# Altium schematic sheet RF Switch.SchDoc
size B; Organization: MASA; SheetNumber: 4; SheetTotal: 7
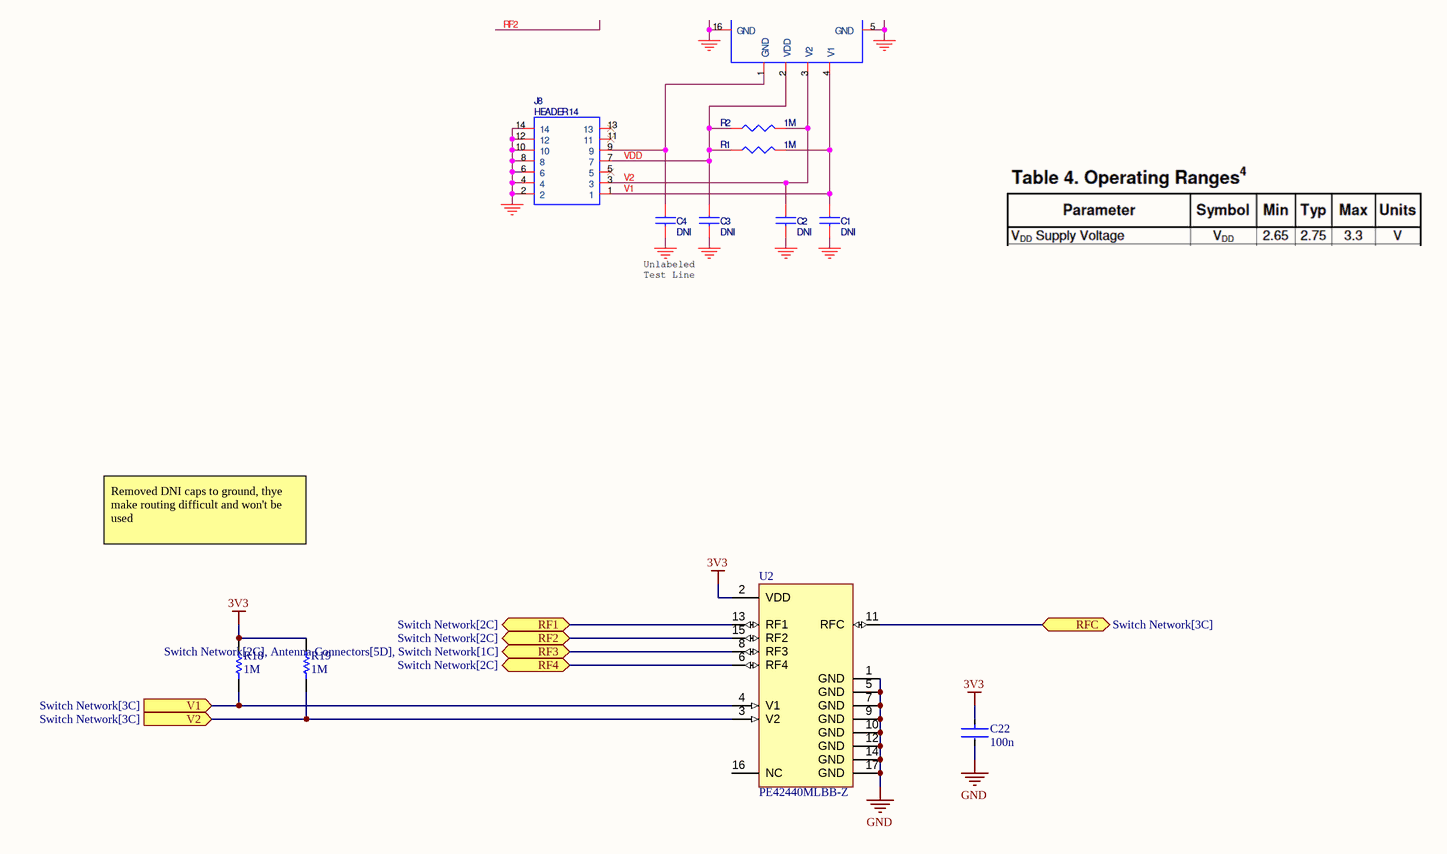
[diagram p0: RF Switch.SchDoc]

## Parts
C22  value 100n  [FP-0603-Capacitor-CL10-IPC_B]  (hidden comment: Ceramic Capacitor 0603)
R18  value 1M  [RESC1608X55X25NL10T15]  (hidden comment: RC0603FR-072K2L)
R19  value 1M  [RESC1608X55X25NL10T15]  (hidden comment: RC0603FR-072K2L)
U2  PE42440MLBB-Z  [PE42440MLBB-Z]

## Ports
RF1 (bidir, see Switch Network[2C]), RF2 (bidir, see Switch Network[2C]), RF3 (bidir, see Switch Network[2C], Antenna Connectors[5D], Switch Network[1C]), RF4 (bidir, see Switch Network[2C]), RFC (bidir, see Switch Network[3C]), V1 (in, see Switch Network[3C]), V2 (in, see Switch Network[3C])

## Nets
3V3: C22.1 R18.2 R19.2 U2.2(VDD)
GND: C22.2 U2.1(GND) U2.5(GND) U2.7(GND) U2.9(GND) U2.10(GND) U2.12(GND) U2.14(GND) U2.17(GND)
RF1: U2.13(RF1) ; port RF1
RF2: U2.15(RF2) ; port RF2
RF3: U2.8(RF3) ; port RF3
RF4: U2.6(RF4) ; port RF4
RFC: U2.11(RFC) ; port RFC
V1: R18.1 U2.4(V1) ; port V1
V2: R19.1 U2.3(V2) ; port V2

Not connected (* = marked no-connect by the designer): U2 16(NC)

## Notes on the sheet
- Removed DNI caps to ground, thye make routing difficult and won't be used
- DWG. NO.
- REV.
- SHT.
- THIS DOCUMENT AND THE DATA DISCLOSED HEREIN OR HEREWITH IS THE PROPERTY OF ALTIUM LIMITED AND MAY BE FREELY DISTRIBUTED IN WHOLE. NO RIGHTS ARE RESERVED OR EXPRESS OR IMPLIED WARANTEE GIVEN.
- REVISION
- DESCRIPTION
- DATE
- APPROVED
- ENG:
- APPROVALS
- PROJECT
- DSN:
- CHK:
- REFERENCE DOCUMENTS
- PROJECT REVISION:
- TITLE
- DOCUMENT REVISION:
- DESIGN ITEM:
- BOM:
- FAB DWG:
- PCB DWG:
- ASSY DWG:
- SCALE:
- SIZE
- B
- CAGE CODE
- FILE NAME
- DWG NO.
- SHEET
- OF
- REV

## Library data of the parts
C22 = Ceramic Capacitor 0603: CAP CER 50V X7R 0603; Manufacturer: KEMET; Manufacturer Part Number: C0603C104K5RACTU; Tolerance: 0.1; Temperature Coefficient: 30ppm/°C; Automotive Grade: Grade 1; Temperature: -55°C to +125°C; RoHS: TRUE; Material: Ceramic; Temperature Range High: +125°C; Lead Free: Yes; Octopart: https://octopart.com/c0603c104k5ractu-kemet-139244; Digikey Description: CAP CER 0.1UF 50V X7R 0603; Category: Cap; Package: C0603C-CF; ComponentLink2Description: Datasheet; Temperature Range Low: -55°C; Device Class L1: Passive Components; Voltage Rating: 50 V; Automotive: Yes; Device Class L3: Ceramic Capacitors; ComponentLink2URL: https://api.kemet.com/component-edge/download/datasheet/C0603C100J5GACAUTO.pdf; Device Class L2: Capacitors; Temperature Characteristic: X7R; Height: 0.87mm; Supplier 1: Mouser; Supplier Part Number 1: 80-C0201C120K3G
R18 R19 = Resistor 0603: Thick Film Resistor, 2.2 KOhm, 100 mW, 50 V, +/- 1%, -55 to 155 degC, 2-Pin SMD (0603), RoHS, Tape and Reel; Manufacturer: Yageo; Temperature Coefficient: 100PPM/C; Voltage Rating: 50V; Power Rating: 100mW; Tolerance: 1%; Datasheet Version: Rev. 7, 05/2017; Case Code - mm: 1608; Series: RC; Mounting Technology: SurfaceMount; Package Description: 2-Pin Surface Mount Device, Body 1.6 x 0.8 mm; Case Code - in: 0603; Package Reference: 0603; Product: ThickFilmResistorsGeneralPurpose; Manufacturer URL: http://www.yageo.com/; Termination Style: SMD/SMT; Operating Temperature Range: -55Cto+155C; Datasheet URL: http://www.yageo.com/documents/recent/PYu-RC_Group_51_RoHS_L_7.pdf; Packaging: Reel
U2 = PE42440MLBB-Z: RF Switch IC General Purpose SP4T 3 GHz 50Ohm 16-QFN (3x3); Supplier 1: Digi-Key; Supplier Part Number 1: 1046-1038-1-ND